# EAGLE design lightSensor_ALS-PT19-315C Breakout (EAGLE 9.6.2)
COMPANY: ADAFRUIT INDUSTRIES; DRAWN: KTOWN; REV: A
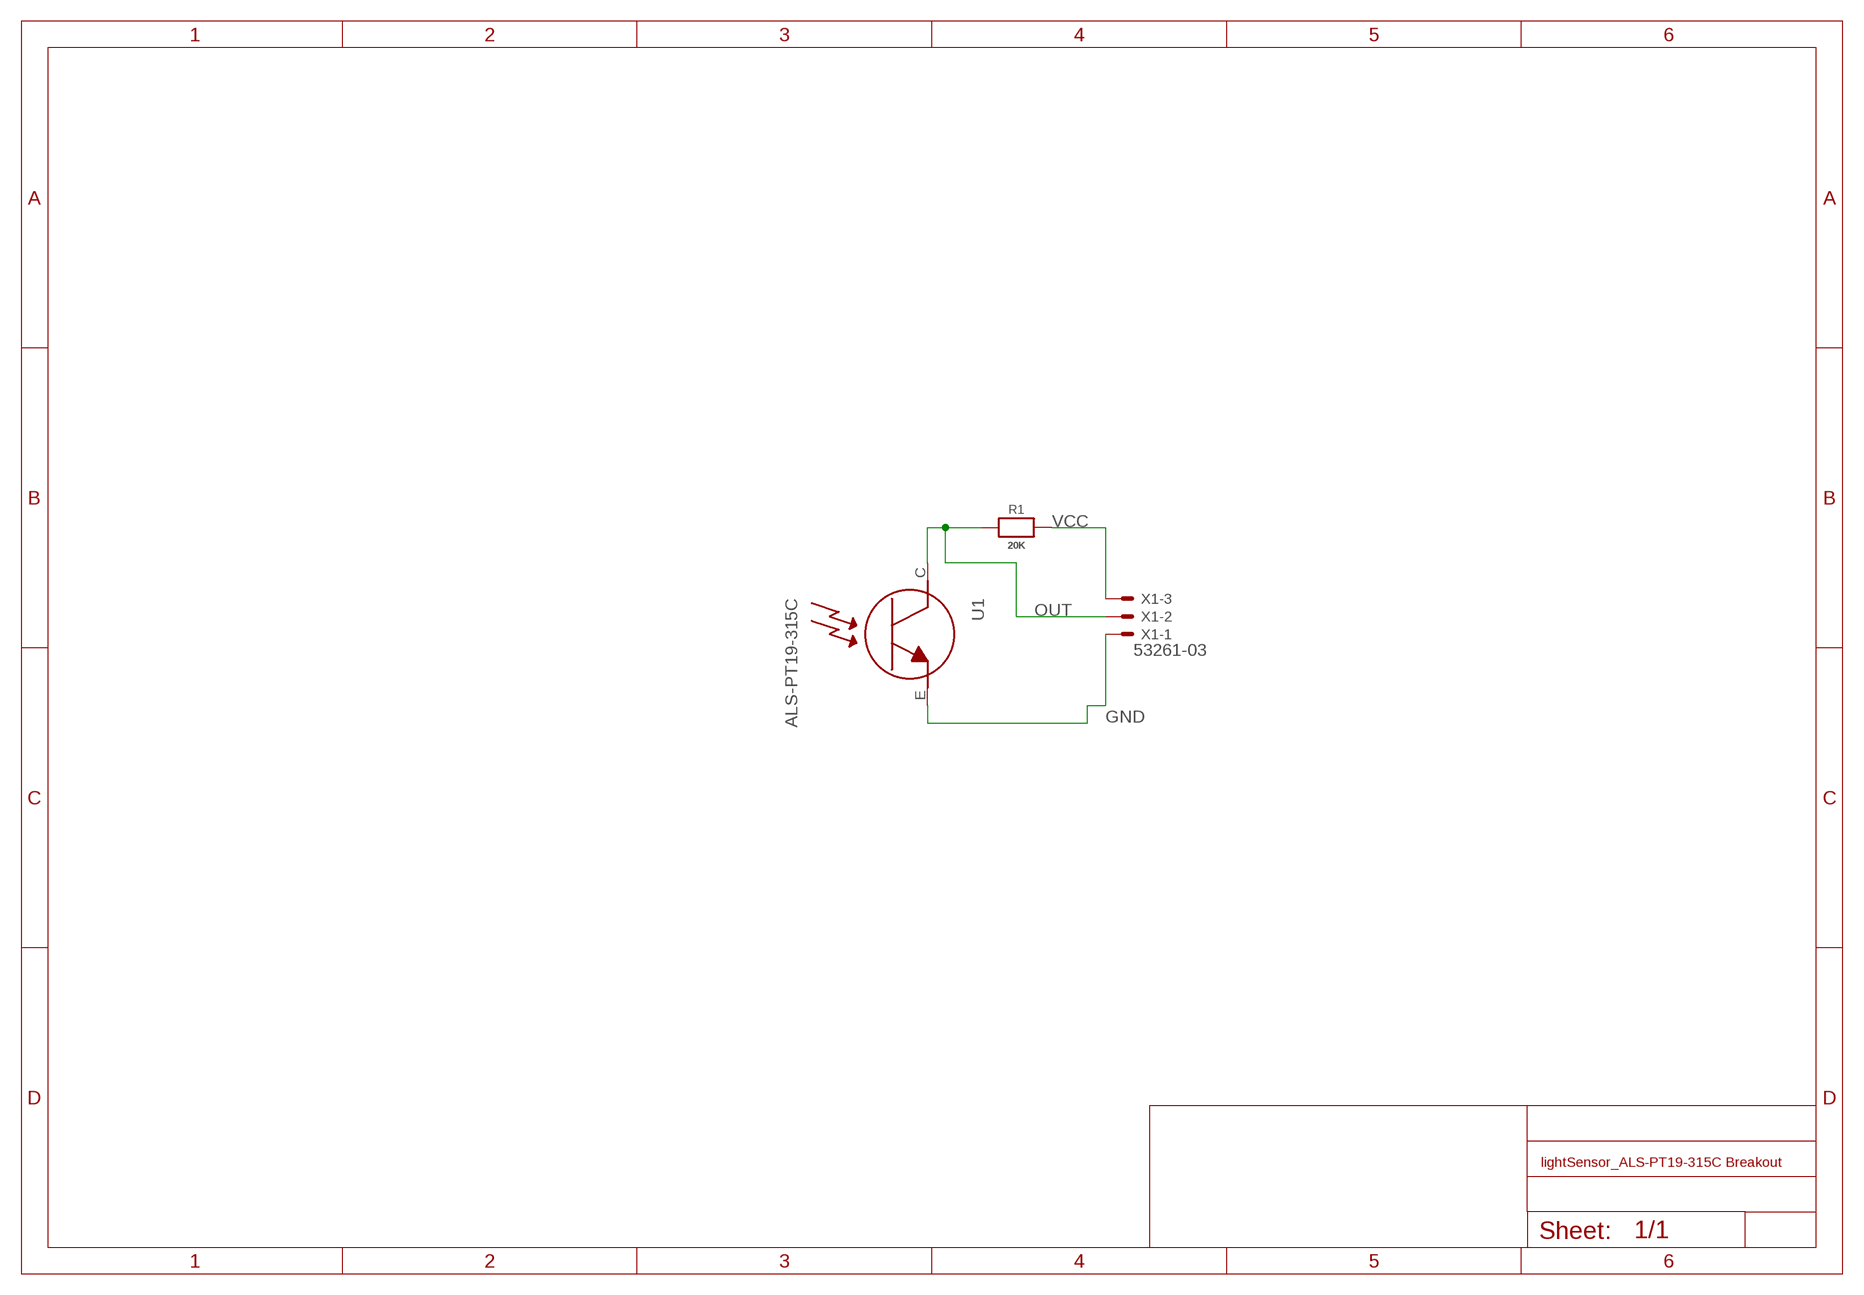
[diagram p0: schematic, sheet 1]

## Parts
R1  20K  RESISTOR_0603_NOOUT  [0603-NO]
U1  ALS-PT19-315C  LIGHT_ALS-PT19-315C  [ALS-PT19-315C]
X1  53261-03  [53261-03]

## Nets
GND: U1.E X1.1
OUT: R1.2 U1.C X1.2
VCC: R1.1 X1.3

## Library data of the parts
R1 = microbuilder:RESISTOR: Resistors For new designs, use the packages preceded by an '_' character since they are more reliable: The following footprints should be used on most boards: _0402 - Standard footprint for regular board layouts _0603 - Standard footprint for regular board layouts _0805 - Standard footprint for regular board layouts _1206 - Standard footprint for regular board layouts For extremely tight-pitch boards where space is at a premium, the following 'micro-pitch' footprints can be used (smaller pads, no silkscreen outline, etc.): _0402MP - Micro-pitch footprint for very dense/compact boards _0603MP - Micro-pitch footprint for very dense/compact boards _0805MP - Micro-pitch footprint for very dense/compact boards _1206MP - Micro-pitch footprint for very dense/compact boards
U1 = microbuilder:LIGHT_ALS-PT19-315C: ALS-PT19-315C - Analog Light Sensor VCC: 2.5-5.5V
X1 = con-molex:53?-03: CONNECTOR wire to board 1.25 mm (.049 inch) pitch header; MF: MOLEX; MPN: 53261-0390; OC_FARNELL: 1125359; OC_NEWARK: 57H5006

## Board
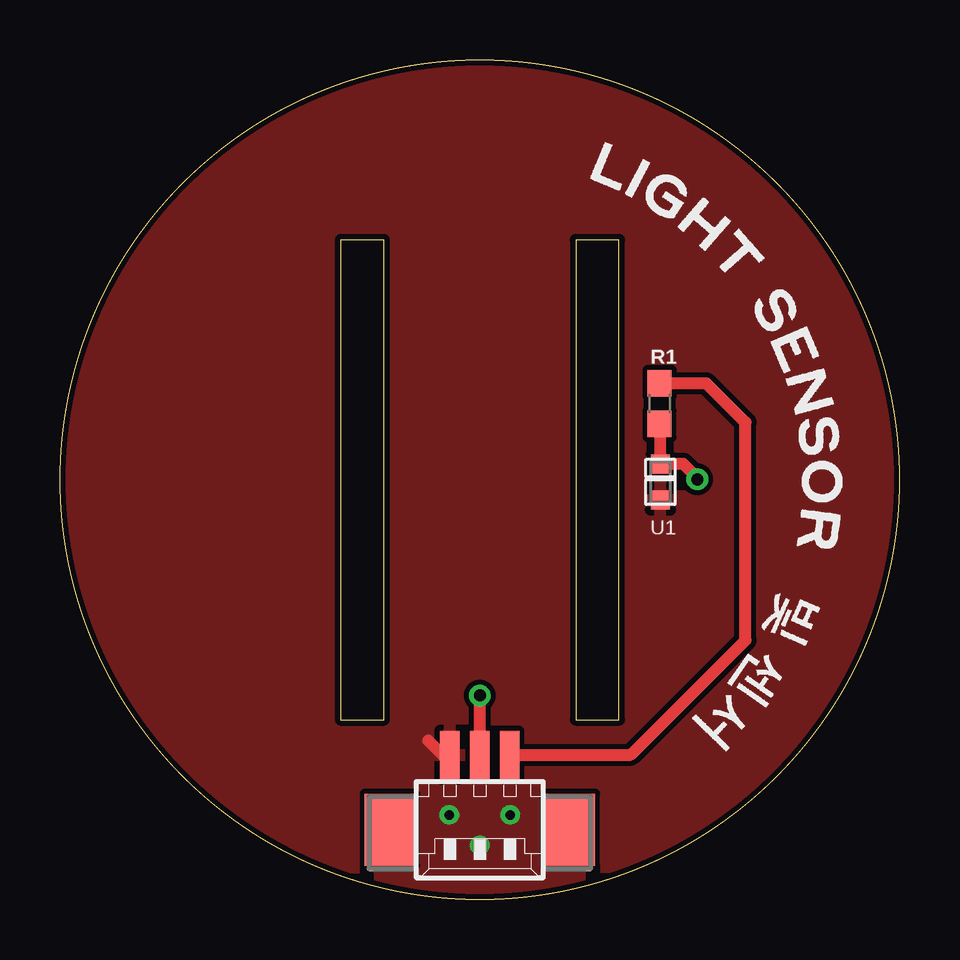
[diagram p1: board, top side]
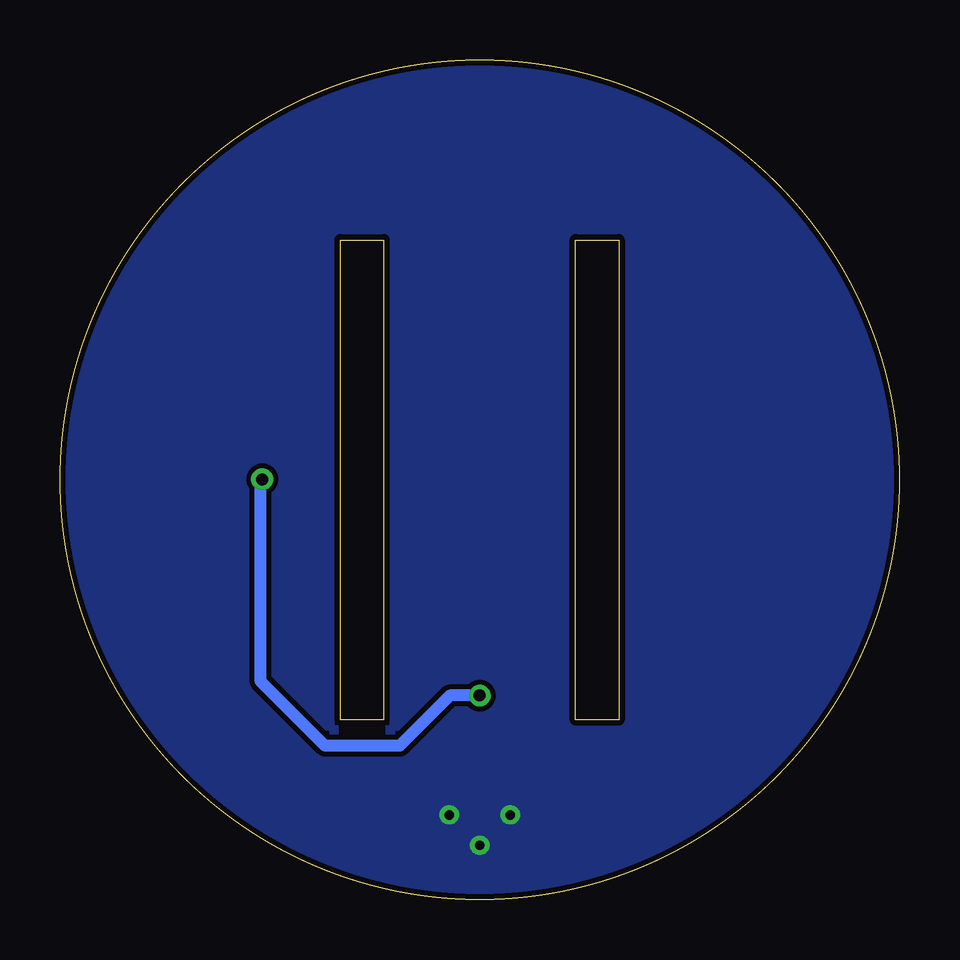
[diagram p2: board, bottom side, seen from below]

Size 35 x 35 mm. Coordinates in mm from the lower left corner, seen from the top.
Outline: 13.5,27.5 11.71,27.5 11.71,7.5 13.5,7.5 13.5,27.5
Outline: 23.3,27.5 21.5,27.5 21.5,7.5 23.3,7.5 23.3,27.5
Outline: circle at 17.5,17.5 radius 17.5
Copper layers (1*16): Top 0.035mm / dielectric 1.5mm / Bottom 0.035mm
Design rules "adafruit": minimum track width 8mil, minimum drill 15.5mil, track to track 8mil, track to pad 8mil, pad to pad 8mil, via to via 8mil, smd to smd 8mil, copper to edge 10mil, drill to drill 8mil, minimum pad ring 10mil, minimum via ring 8mil, stop-mask expansion 2mil, vias tented up to drill 20mil, thermal gap 10mil

### Footprints (pad centres in the part's own frame; a part is rotated, then mirrored left to right if it is on the bottom)
0603-NO = smd 1.1 x 1: 1 -0.85,0; 2 0.85,0
ALS-PT19-315C = smd 0.8 x 0.8: C -0.75,0; E 0.75,0
53261-03 = smd 0.8 x 2: 1 1.25,-2.5; 2 0,-2.5; 3 -1.25,-2.5 | smd 2.1 x 3: S1 3.75,0.625; S2 -3.75,0.625

### Placement (x,y rotation side)
R1  25,20.68 270 top
U1  25.03,17.41 270 top
X1  17.5,3.54 180 top

### Tracks (layer width: path | path; a pad name or v marks a point on that pad's centre or on a via)
GND  (via drill 0.39)
  Top 0.508: X1.1 15.95,6.04 15.35,6.63
  other vias: 17.5,2.26 16.23,3.53 18.77,3.53
  pour Top: -0.28,0.99 -0.28,35.28 35.28,35.28 35.28,-0.28 -1.55,-0.28
  pour Bottom: -2.82,18.77 -2.82,37.82 37.82,37.82 37.82,-1.55 37.82,-2.82 -4.09,-2.82 -2.82,-1.55
OUT  (via drill 0.5)
  Top 0.508: X1.2 v17.5,8.5 | v26.56,17.52 v26.57,17.52 26.57,17.57 25.98,18.16 U1.C 25.03,19.8 R1.2
  Bottom 0.508: v17.5,8.5 18.74,8.5 20.84,6.41 23.94,6.41 26.65,9.12 26.65,17.44 v26.57,17.52
VCC
  Top 0.508: X1.3 23.8,6.04 28.57,10.81 28.57,19.89 26.94,21.53 R1.1

### Text on the board
tPlace: U1